# EAGLE schematic Z80UARTTEST (EAGLE 6.1)
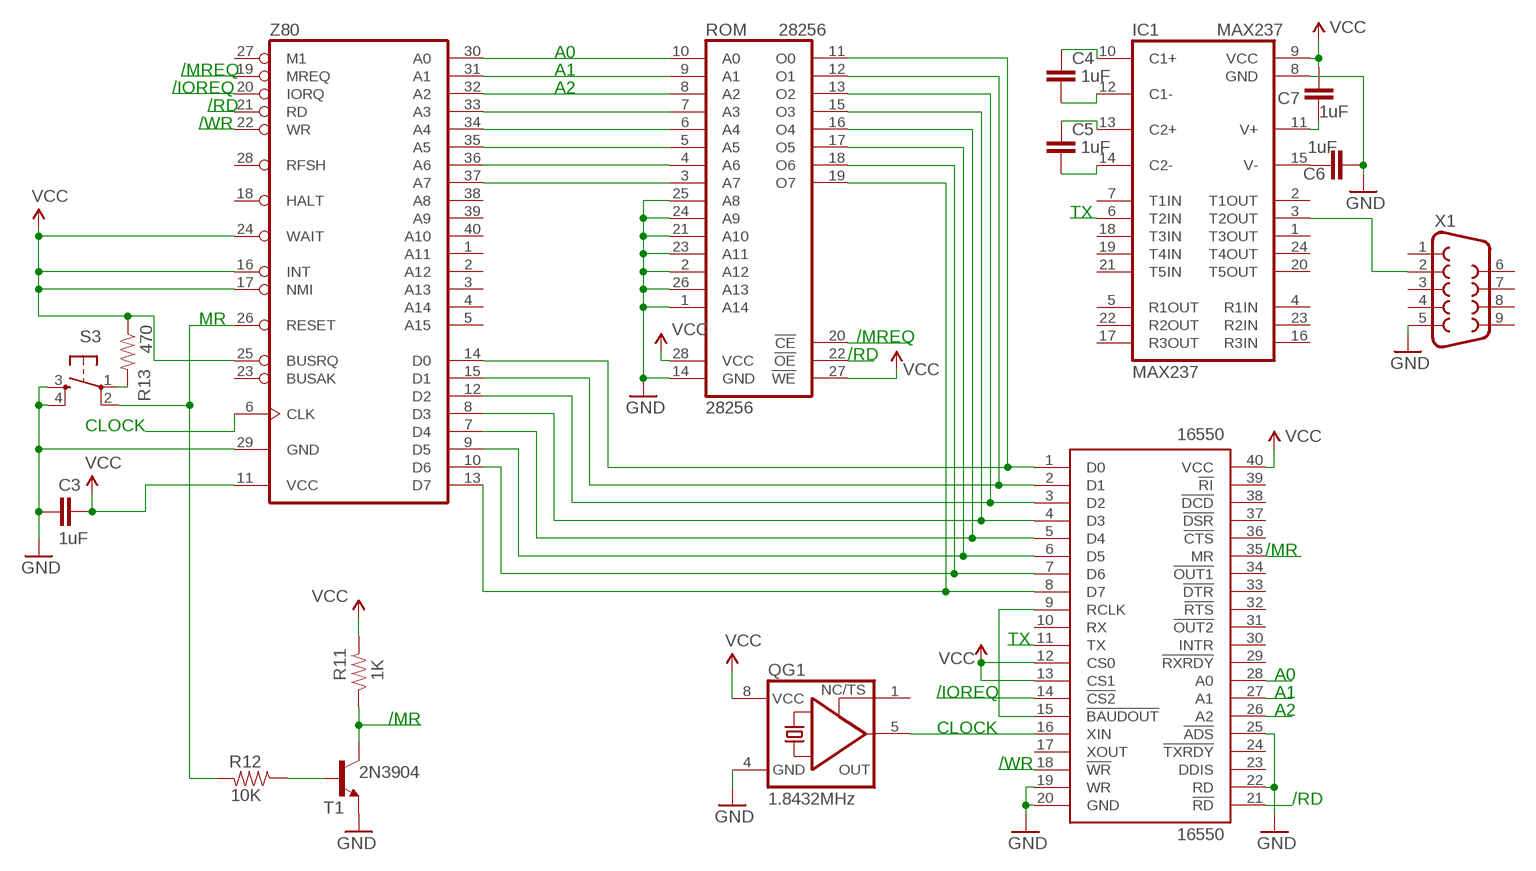
[diagram p0: schematic, sheet 1]

## Parts
C3  1uF  CAP  [E5-5]
C4  1uF  CAP  [E5-5]
C5  1uF  CAP  [E5-5]
C6  1uF  CAP  [E5-5]
C7  1uF  CAP  [E5-5]
IC1  MAX237  [DIL24-3]
QG1  1.8432MHz  XO-8  [DIL08S]
R11  1K  RESISTORPTH-1/4W  [AXIAL-0.4]
R12  10K  RESISTORPTH-1/4W  [AXIAL-0.4]
R13  470  RESISTORPTH-1/4W  [AXIAL-0.4]
ROM  28256  [DIL28]
S3  TAC_SWITCHPTH  [TACTILE-PTH]
T1  2N3904  [TO92]
U$1  16550  [DIL40]
X1  DB9FEMALE  [DB9]
Z80  Z80CPU  [DIL40]

## Nets
/IOREQ: U$1.14(!CS2) Z80.20(IORQ)
/MR: R11.P$1 T1.1(C) U$1.35(MR)
/MREQ: ROM.20(!CE) Z80.19(MREQ)
/RD: ROM.22(!OE) U$1.21(!RD) Z80.21(RD)
/WR: U$1.18(!WR) Z80.22(WR)
A0: ROM.10(A0) U$1.28(A0) Z80.30(A0)
A1: ROM.9(A1) U$1.27(A1) Z80.31(A1)
A2: ROM.8(A2) U$1.26(A2) Z80.32(A2)
CLOCK: QG1.5(OUT) U$1.16(XIN) Z80.6(CLK)
GND: C3.- C6.+ IC1.8(GND) QG1.4(GND) ROM.1(A14) ROM.2(A12) ROM.14(GND) ROM.21(A10) ROM.23(A11) ROM.24(A9) ROM.25(A8) ROM.26(A13) S3.3 S3.4 T1.3(E) U$1.19(WR) U$1.20(GND) U$1.22(RD) U$1.25(!ADS) X1.5 Z80.29(GND)
MR: R12.P$2 S3.2 Z80.26(RESET)
N$1: U$1.9(RCLK) U$1.15(!BAUDOUT)
N$5: ROM.11(O0) U$1.1(D0) Z80.14(D0)
N$6: C4.+ IC1.10(C1+)
N$7: C4.- IC1.12(C1-)
N$8: C5.+ IC1.13(C2+)
N$9: C5.- IC1.14(C2-)
N$10: C6.- IC1.15(V-)
N$11: C7.+ IC1.11(V+)
N$12: ROM.12(O1) U$1.2(D1) Z80.15(D1)
N$13: IC1.3(T2OUT) X1.2
N$14: ROM.13(O2) U$1.3(D2) Z80.12(D2)
N$15: ROM.15(O3) U$1.4(D3) Z80.8(D3)
N$16: ROM.16(O4) U$1.5(D4) Z80.7(D4)
N$17: ROM.17(O5) U$1.6(D5) Z80.9(D5)
N$18: ROM.18(O6) U$1.7(D6) Z80.10(D6)
N$19: ROM.19(O7) U$1.8(D7) Z80.13(D7)
N$24: ROM.7(A3) Z80.33(A3)
N$25: ROM.6(A4) Z80.34(A4)
N$26: ROM.5(A5) Z80.35(A5)
N$27: ROM.4(A6) Z80.36(A6)
N$28: ROM.3(A7) Z80.37(A7)
N$29: R12.P$1 T1.2(B)
N$39: R13.P$2 S3.1
TX: IC1.6(T2IN) U$1.11(TX)
VCC: C3.+ C7.- IC1.9(VCC) QG1.8(VCC) R11.P$2 R13.P$1 ROM.27(!WE) ROM.28(VCC) U$1.12(CS0) U$1.13(CS1) U$1.40(VCC) Z80.11(VCC) Z80.16(INT) Z80.17(NMI) Z80.24(WAIT) Z80.25(BUSRQ)
Unconnected: IC1.1(T3OUT) IC1.2(T1OUT) IC1.4(R1IN) IC1.5(R1OUT) IC1.7(T1IN) IC1.16(R3IN) IC1.17(R3OUT) IC1.18(T3IN) IC1.19(T4IN) IC1.20(T5OUT) IC1.21(T5IN) IC1.22(R2OUT) IC1.23(R2IN) IC1.24(T4OUT) QG1.1(TS) U$1.10(RX) U$1.17(XOUT) U$1.23(DDIS) U$1.24(!TXRDY) U$1.29(!RXRDY) U$1.30(INTR) U$1.31(!OUT2) U$1.32(!RTS) U$1.33(!DTR) U$1.34(!OUT1) U$1.36(!CTS) U$1.37(!DSR) U$1.38(!DCD) U$1.39(!RI) X1.1 X1.3 X1.4 X1.6 X1.7 X1.8 X1.9 Z80.1(A11) Z80.2(A12) Z80.3(A13) Z80.4(A14) Z80.5(A15) Z80.18(HALT) Z80.23(BUSAK) Z80.27(M1) Z80.28(RFSH) Z80.38(A8) Z80.39(A9) Z80.40(A10)

## Notes on the sheet
- A0
- /MREQ | A1
- /IOREQ | A2
- /RD
- /WR
- TX
- MR
- /MREQ
- /RD
- CLOCK
- 16550
- /MR
- TX
- A0
- /IOREQ | A1
- A2
- /MR
- CLOCK
- /WR
- /RD
- 16550

## Library data of the parts
C3-C7 = MCParts:CAP: Capacitor Standard 0603 ceramic capacitor, and 0.1" leaded capacitor.
IC1 = MCParts:MAX237: RS232 TRANSEIVER; MPN: MAX237CNG+
QG1 = MCParts:XO-: CRYSTAL; OC_FARNELL: unknown; OC_NEWARK: unknown
R11-R13 = MCParts:RESISTOR: Resistor Basic schematic elements and footprints for 0603, 1206, and PTH resistors.
ROM = MCParts:28256
S3 = MCParts:TAC_SWITCH: Momentary Switch Button commonly used for reset or general input. Spark Fun Electronics SKU : COM-00097
T1 = transistor:2N3904: NPN TRANSISTOR
U$1 = MCParts:16550
X1 = MCParts:DB9: DB9 Connector Standard DB9 (D-Sub 9) serial connector. Can be used for CAN bus as well as RS485 and RS232. Footprint production proven. Spark Fun Electronics SKU : PRT-00429
Z80 = zilog:Z80CPU: Z80 FAMILY DEVICE